# EAGLE design digital_clock_v2 (EAGLE 5.11)
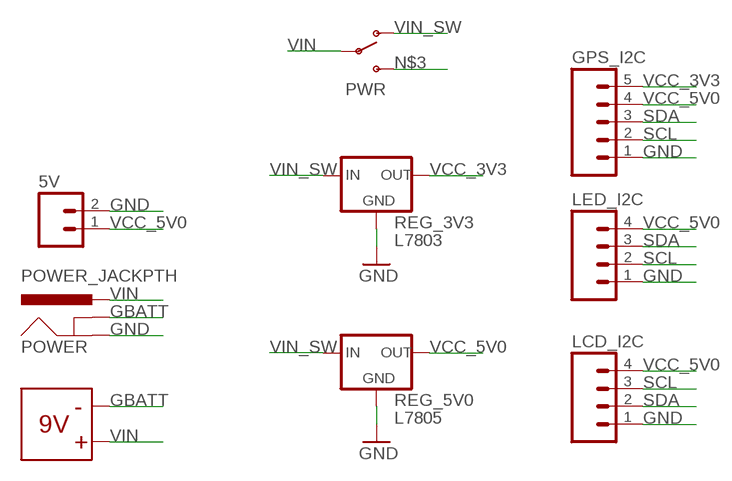
[diagram p0: schematic, sheet 1]

## Parts
5V  M02  [1X02_LONGPADS]
9V_BATTERY  BATTERY-BH9V  [BATTERY-BH9V]
GPS_I2C  M05PTH_LONGPADS  [1X05_LONGPADS]
LCD_I2C  M04LONGPADS  [1X04_LONGPADS]
LED_I2C  M04LONGPADS  [1X04_LONGPADS]
POWER  POWER_JACKPTH  [POWER_JACK_PTH]
PWR  SWITCH-SPSTPTH  [SWITCH-SPDT]
REG_3V3  L7803  V_REG_78XXSIDE  [78XXL]
REG_5V0  L7805  V_REG_78XXSIDE  [78XXL]

## Nets
GBATT [supply]: 9V_BATTERY.9V- POWER.GNDBREAK
GND [supply]: 5V.2 GPS_I2C.1 LCD_I2C.1 LED_I2C.1 POWER.GND REG_3V3.GND REG_5V0.GND
N$3: PWR.3(S)
SCL: GPS_I2C.2 LCD_I2C.3 LED_I2C.2
SDA: GPS_I2C.3 LCD_I2C.2 LED_I2C.3
VCC_3V3 [supply]: GPS_I2C.5 REG_3V3.OUT
VCC_5V0 [supply]: 5V.1 GPS_I2C.4 LCD_I2C.4 LED_I2C.4 REG_5V0.OUT
VIN [supply]: 9V_BATTERY.9V+ POWER.PWR PWR.2(P)
VIN_SW [supply]: PWR.1(O) REG_3V3.IN REG_5V0.IN

## Library data of the parts
5V = SparkFun:M02: Header 2 Standard 2-pin 0.1" header. Use with straight break away headers (SKU : PRT-00116), right angle break away headers (PRT-00553), swiss pins (PRT-00743), machine pins (PRT-00117), and female headers (PRT-00115). Molex polarized connector foot print use with SKU : PRT-08233 with associated crimp pins and housings.
9V_BATTERY = jcole:BATTERY-BH9V: Battery holder for 9V batteries, Digikey PN BH9V-PC-ND
GPS_I2C = SparkFun:M05: Header 5 Standard 5-pin 0.1" header. Use with straight break away headers (SKU : PRT-00116), right angle break away headers (PRT-00553), swiss pins (PRT-00743), machine pins (PRT-00117), and female headers (PRT-00115). Molex polarized connector foot print use with SKU : PRT-08230 with associated crimp pins and housings.
LCD_I2C LED_I2C = SparkFun:M04: Header 4 Standard 4-pin 0.1" header. Use with straight break away headers (SKU : PRT-00116), right angle break away headers (PRT-00553), swiss pins (PRT-00743), machine pins (PRT-00117), and female headers (PRT-00115). Molex polarized connector foot print use with SKU : PRT-08231 with associated crimp pins and housings.
POWER = SparkFun:POWER_JACK: Power Jack This is the standard 5.5mm barrel jack for power. The PTH is the most common, proven, reliable, footprint. All others are experimental. The Slot footprint only works if the mill layer is transmitted to the PCB fab house so be warned. Spark Fun Electronics SKU : PRT-00119. Mating wall wart : TOL-00298 (and others)
PWR = SparkFun:SWITCH-SPST: SPST Switch Simple slide switch. Spark Fun Electronics SKU : COM-00102
REG_3V3 REG_5V0 = SparkFun:V_REG_78XX: Voltage Regulator Standard 7805 5V regulator. IGO (Input Ground Output). Spark Fun Electronics SKU : COM-00107

## Net classes
0 default: width 0.406 mm, clearance 0.254 mm
1 supply: width 0.762 mm, clearance 0.381 mm

## Board
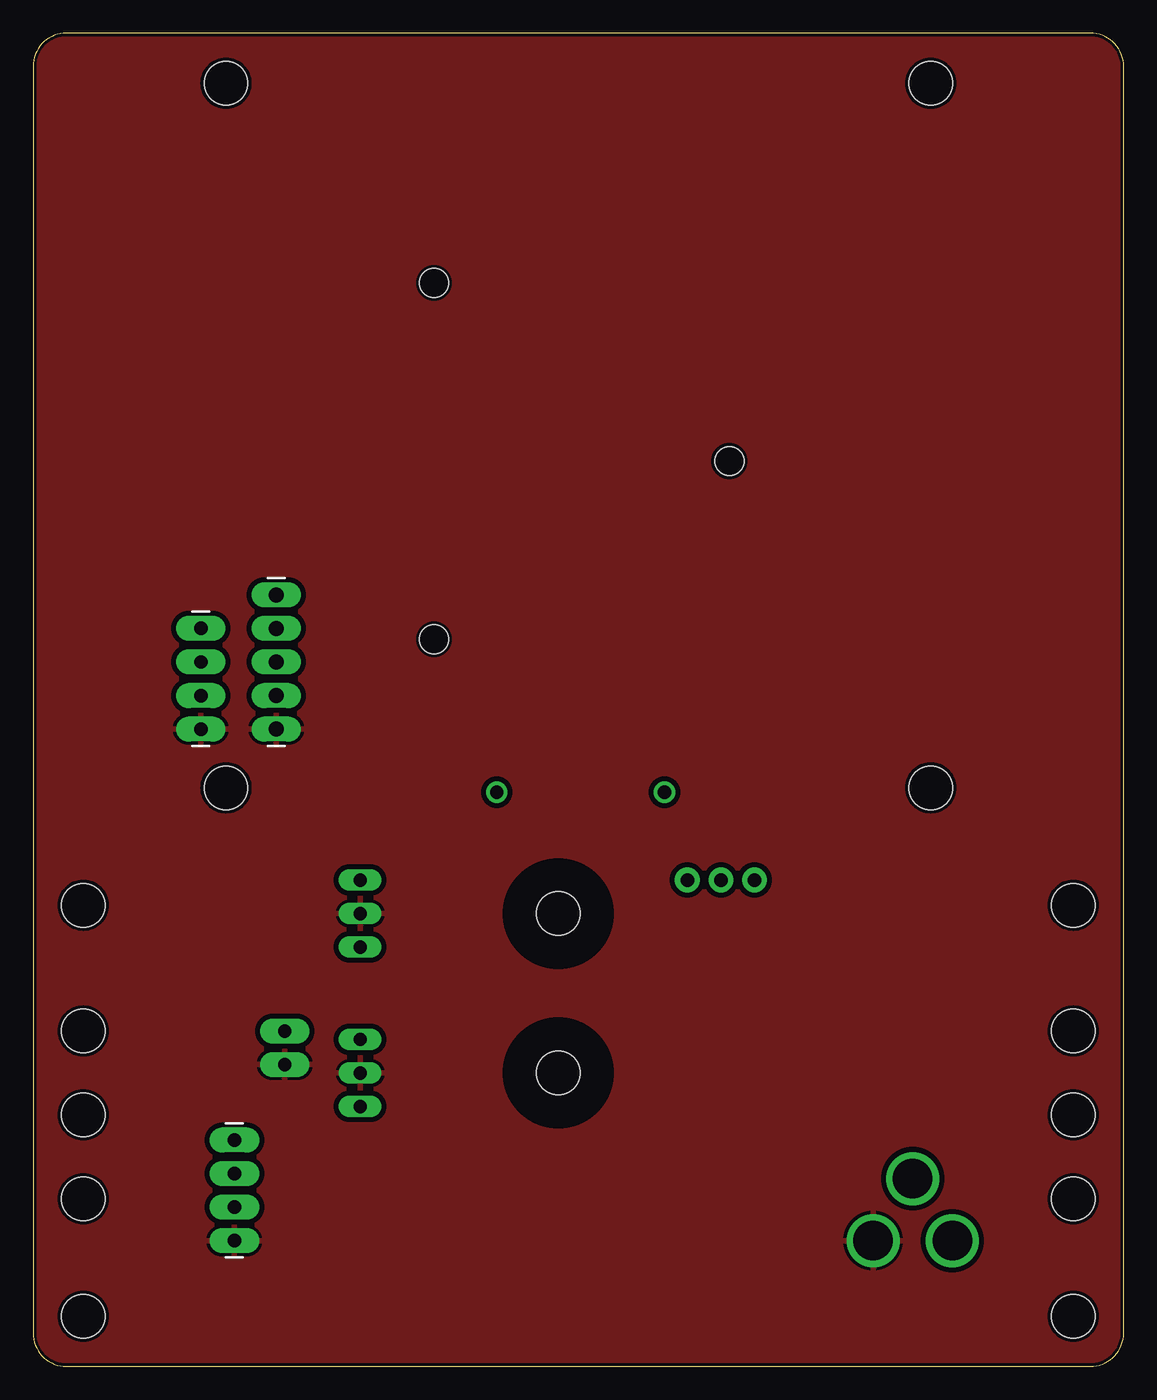
[diagram p1: board, top side]
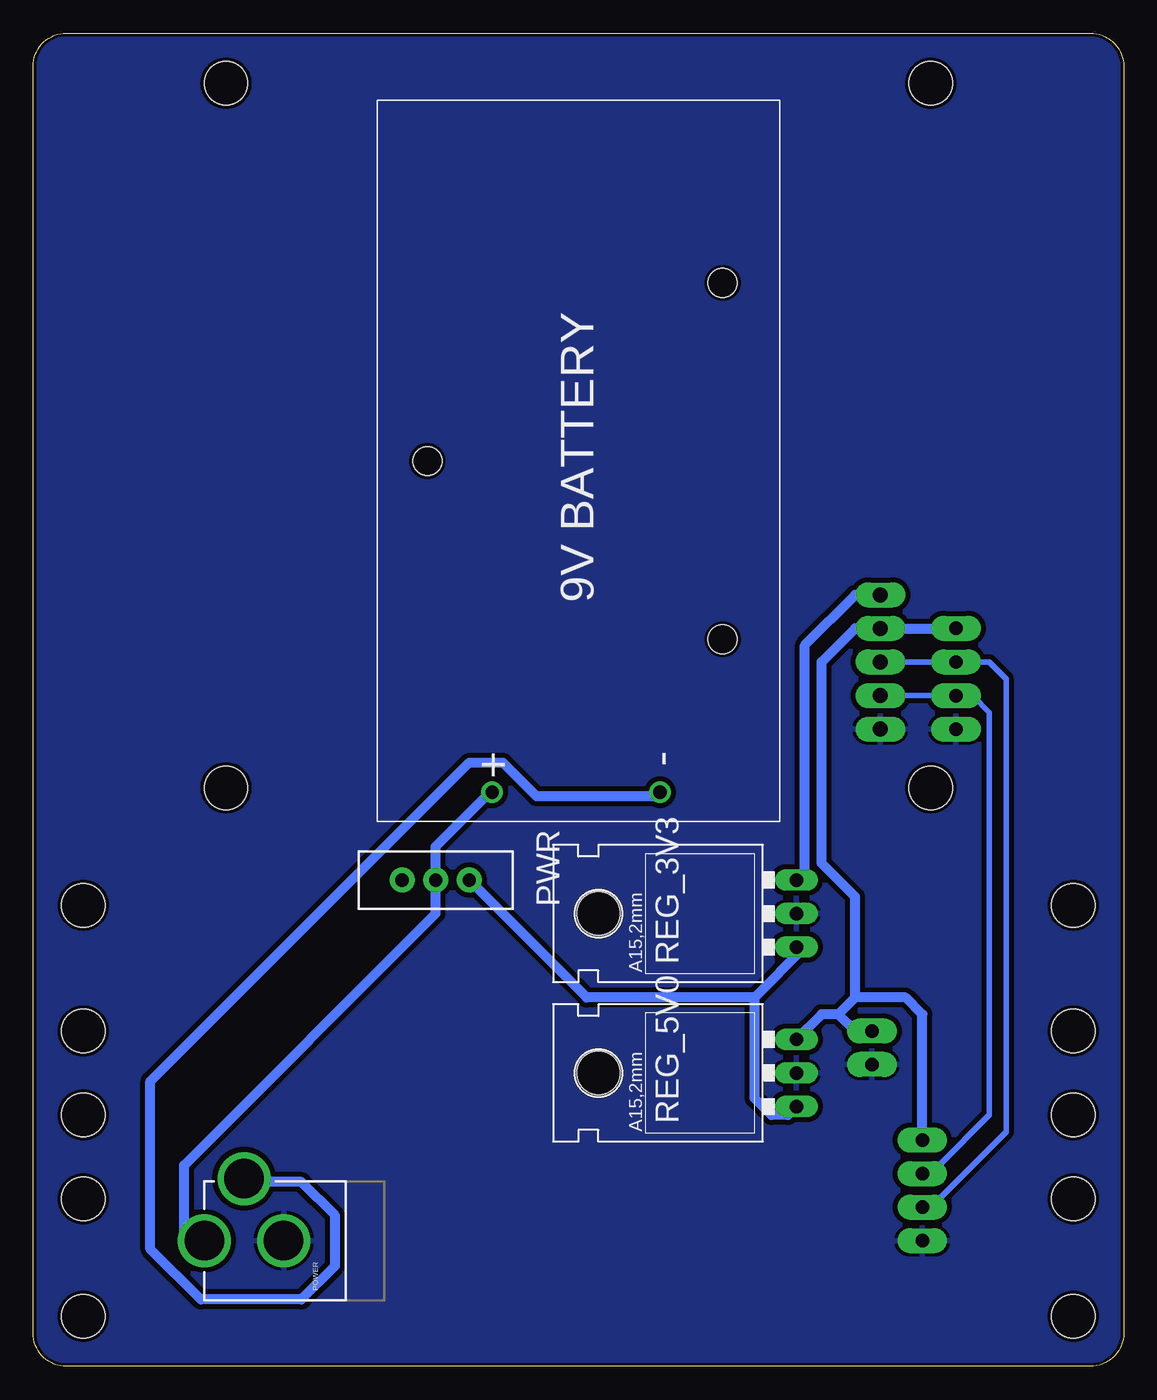
[diagram p2: board, bottom side, seen from below]

Size 82.55 x 100.97 mm. Coordinates in mm from the lower left corner, seen from the top.
Outline: 2.54,100.97 arc90 0,98.42 0,2.54 arc90 2.54,0 80.01,0 arc90 82.55,2.54 82.55,98.42 arc90 80.01,100.97 2.54,100.97
Copper layers (1*16): Top 0.035mm / dielectric 1.5mm / Bottom 0.035mm
Design rules "SparkFun": minimum track width 8mil, minimum drill 20mil, track to track 8mil, track to pad 8mil, pad to pad 8mil, via to via 8mil, smd to smd 8mil, copper to edge 10mil, drill to drill 8mil, minimum pad ring 12mil, minimum via ring 10mil, stop-mask expansion 4mil, vias tented up to drill 25mil, thermal gap 10mil

### Footprints (pad centres in the part's own frame; a part is rotated, then mirrored left to right if it is on the bottom)
1X02_LONGPADS = drill 1.016 pad 1.88 long: 1 0,0; 2 2.54,0
BATTERY-BH9V = drill 1 round: 9V+ 25.73,-6.528; 9V- 25.73,6.172 | hole 2.2: 0.66,-11.43; -12.827,10.922; 14.148,10.922
1X05_LONGPADS = drill 1.118 pad 1.88 long: 1 0,0; 2 2.54,0; 3 5.08,0; 4 7.62,0; 5 10.16,0
1X04_LONGPADS = drill 1.016 pad 1.88 long: 1 0,0; 2 2.54,0; 3 5.08,0; 4 7.62,0
POWER_JACK_PTH = drill 2.997 round: GND 0,7.7; GNDBREAK 4.7,10.7; PWR 0,13.7
SWITCH-SPDT = drill 1.016 pad 1.88 round: 1 0,2.54; 2 0,0; 3 0,-2.54
78XXL = drill 1.016 long: GND 0,-3.81; IN -2.54,-3.81; OUT 2.54,-3.81 | hole 3.302: 0,11.176
STAND-OFF = hole 3.302: 0,0

### Placement (x,y rotation side)
5V  19.05,25.4 270 top
9V_BATTERY  41.27,69.22 270 bottom
GPS_I2C  18.41,48.26 90 top
LCD_I2C  15.24,9.53 90 top
LED_I2C  12.7,48.26 90 top
POWER  55.88,9.53 90 bottom
PWR  52.07,36.83 270 bottom
REG_3V3  28.57,34.29 90 bottom
REG_5V0  28.57,22.23 90 bottom
U$1  [STAND-OFF]  14.61,97.16 0 top
U$2  [STAND-OFF]  67.94,97.16 0 top
U$3  [STAND-OFF]  67.94,43.81 0 top
U$4  [STAND-OFF]  14.61,43.81 0 top
U$5  [STAND-OFF]  3.81,34.92 0 top
U$6  [STAND-OFF]  78.74,34.92 0 top
U$7  [STAND-OFF]  78.74,3.81 0 top
U$8  [STAND-OFF]  3.81,3.81 0 top
U$9  [STAND-OFF]  78.74,25.4 0 top
U$10  [STAND-OFF]  3.81,25.4 0 top
U$11  [STAND-OFF]  3.81,19.05 0 top
U$12  [STAND-OFF]  3.81,12.7 0 top
U$13  [STAND-OFF]  78.74,19.05 0 top
U$14  [STAND-OFF]  78.74,12.7 0 top

### Tracks (layer width: path | path; a pad name or v marks a point on that pad's centre or on a via)
GBATT
  Bottom 0.762: 9V_BATTERY.9V- 35.56,43.18 44.45,43.18 46.99,45.72 49.53,45.72 73.66,21.59 73.66,8.89 69.85,5.08 62.23,5.08 59.69,7.62 59.69,11.43 62.23,13.97 66.04,13.97 POWER.GNDBREAK
GND
  pour Bottom: 80.01,0 arc90 82.55,2.54 82.55,98.42 arc90 80.01,100.97 2.54,100.97 arc90 0,98.42 0,2.54 arc90 2.54,0
  pour Top: 80.01,0 arc90 82.55,2.54 82.55,98.42 arc90 80.01,100.97 2.54,100.97 arc90 0,98.42 0,2.54 arc90 2.54,0
SCL
  Bottom 0.406: LCD_I2C.3 15.24,15.24 13.97,15.24 10.16,19.05 10.16,49.53 11.43,50.8 LED_I2C.2 GPS_I2C.2
SDA
  Bottom 0.406: LCD_I2C.2 15.24,12.7 13.97,12.7 8.89,17.78 8.89,52.07 10.16,53.34 LED_I2C.3 GPS_I2C.3
VCC_3V3
  Bottom 0.762: REG_3V3.OUT 24.13,36.83 24.13,54.61 20.32,58.42 GPS_I2C.5
VCC_5V0
  Bottom 0.762: LED_I2C.4 GPS_I2C.4 20.32,55.88 22.86,53.34 22.86,38.1 20.32,35.56 20.32,27.94 | 21.59,26.67 22.86,26.67 REG_5V0.OUT | 21.59,26.67 20.32,25.4 5V.1 | 20.32,27.94 16.51,27.94 15.24,26.67 LCD_I2C.4 | 20.32,27.94 21.59,26.67
VIN
  Bottom 0.762: 9V_BATTERY.9V+ 48.26,43.18 52.07,39.37 PWR.2 52.07,34.29 71.12,15.24 71.12,10.16 69.85,8.89 POWER.PWR
VIN_SW
  Bottom 0.762: 27.94,27.94 27.94,20.32 26.67,19.05 25.4,19.05 REG_5V0.IN | 27.94,27.94 24.13,31.75 REG_3V3.IN | PWR.1 40.64,27.94 27.94,27.94

### Text on the board
tOrigins: Digital Clock v2 | Digital Clock v2
bOrigins: jeremy@jcole.us | 2012-03-23 | (c) 2012 Jeremy Cole | Digital Clock v2